# EAGLE schematic smart_probe (EAGLE 9.6.0)
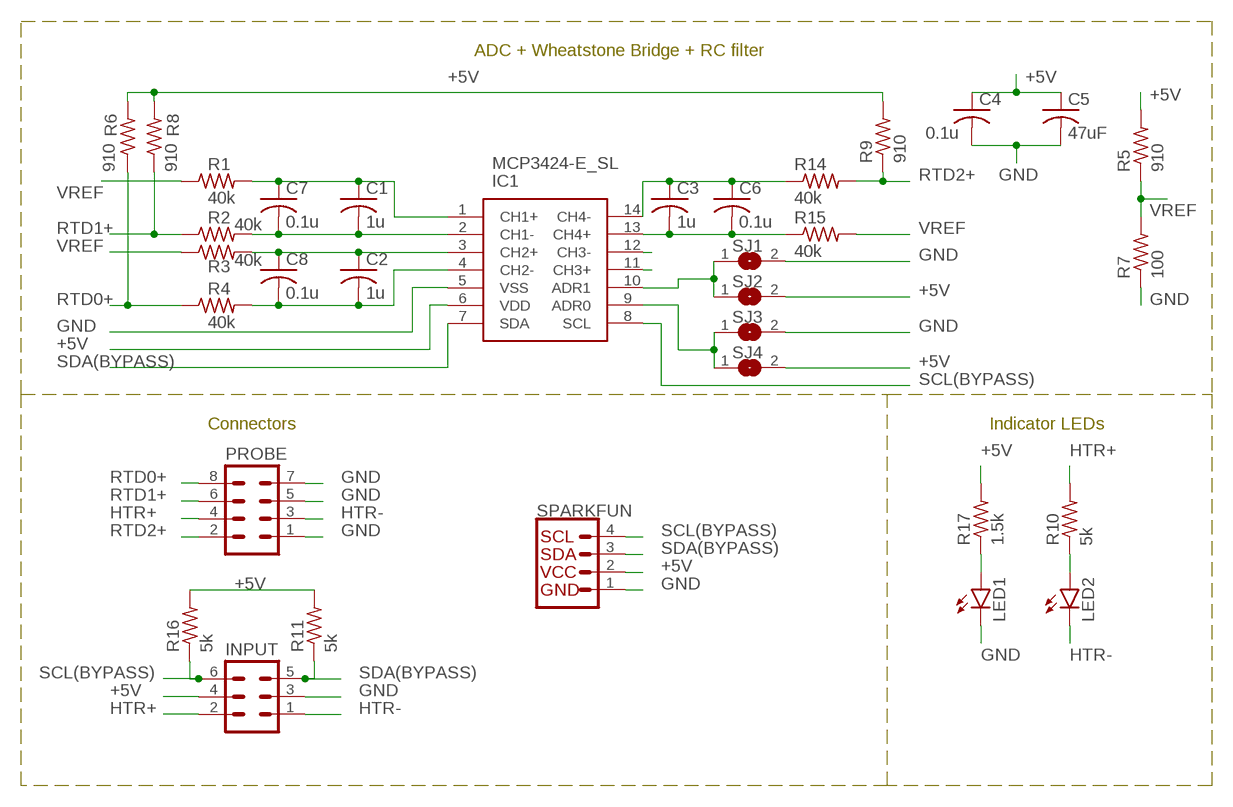
[diagram p0: schematic, sheet 1]

## Parts
C1  1u  C-USC0805  [C0805]
C2  1u  C-USC0805  [C0805]
C3  1u  C-USC0805  [C0805]
C4  0.1u  C-USC0805  [C0805]
C5  47uF  C-USC0805  [C0805]
C6  0.1u  C-USC0805  [C0805]
C7  0.1u  C-USC0805  [C0805]
C8  0.1u  C-USC0805  [C0805]
IC1  MCP3424-E_SL  [SOIC127P600X175-14N]
INPUT  MA03-2  [MA03-2]
LED1  LEDCHIP-LED0805  [CHIP-LED0805]
LED2  LEDCHIP-LED0805  [CHIP-LED0805]
PROBE  MA04-2  [MA04-2]
R1  40k  R-US_R0805  [R0805]
R2  40k  R-US_R0805  [R0805]
R3  40k  R-US_R0805  [R0805]
R4  40k  R-US_R0805  [R0805]
R5  910  R-US_R0805  [R0805]
R6  910  R-US_R0805  [R0805]
R7  100  R-US_R0805  [R0805]
R8  910  R-US_R0805  [R0805]
R9  910  R-US_R0805  [R0805]
R10  5k  R-US_R0805  [R0805]
R11  5k  R-US_R0805  [R0805]
R14  40k  R-US_R0805  [R0805]
R15  40k  R-US_R0805  [R0805]
R16  5k  R-US_R0805  [R0805]
R17  1.5k  R-US_R0805  [R0805]
SJ1  SJ  [SJ]
SJ2  SJ  [SJ]
SJ3  SJ  [SJ]
SJ4  SJ  [SJ]
SPARKFUN  I2C_STANDARD_NO_SILK  [1X04_NO_SILK]

## Nets
+5V: C4.1 C5.1 IC1.6(VDD) INPUT.4 R5.2 R6.2 R8.2 R9.2 R11.2 R16.2 R17.2 SJ2.2 SJ4.2 SPARKFUN.2(VCC)
CH1+: C1.1 C7.1 IC1.1(CH1+) R1.2
CH1-: C1.2 C7.2 IC1.2(CH1-) R2.2
CH2+: C2.1 C8.1 IC1.3(CH2+) R3.2
CH2-: C2.2 C8.2 IC1.4(CH2-) R4.2
CH3+: IC1.11(CH3+)
CH3-: IC1.12(CH3-)
CH4+: C3.2 C6.2 IC1.13(CH4+) R15.1
CH4-: C3.1 C6.1 IC1.14(CH4-) R14.1
GND: C4.2 C5.2 IC1.5(VSS) INPUT.3 LED1.C PROBE.1 PROBE.5 PROBE.7 R7.1 SJ1.2 SJ3.2 SPARKFUN.1(GND)
HTR+: INPUT.2 PROBE.4 R10.2
HTR-: INPUT.1 LED2.C PROBE.3
N$1: LED1.A R17.1
N$2: LED2.A R10.1
N$4: IC1.10(ADR1) SJ1.1 SJ2.1
N$5: IC1.9(ADR0) SJ3.1 SJ4.1
RTD0+: PROBE.8 R4.1 R6.1
RTD1+: PROBE.6 R2.1 R8.1
RTD2+: PROBE.2 R9.1 R14.2
SCL(BYPASS): IC1.8(SCL) INPUT.6 R16.1 SPARKFUN.4(SCL)
SDA(BYPASS): IC1.7(SDA) INPUT.5 R11.1 SPARKFUN.3(SDA)
VREF: R1.1 R3.1 R5.1 R7.2 R15.2

## Notes on the sheet
- ADC + Wheatstone Bridge + RC filter
- Connectors | Indicator LEDs

## Library data of the parts
C1-C8 = rcl:C-US: CAPACITOR, American symbol; SPICEPREFIX: C
IC1 = MCP3424-E_SL:MCP3424-E_SL: ADC 18-Bit 4-ch 2.048V I2C SOIC14 Source: Datasheet <http://ww1.microchip.com/downloads/en/DeviceDoc/22088c.pdf>; ALLIED_NUMBER: 70046797; ALLIED_PRICE-STOCK: http://www.alliedelec.com/microchip-technology-inc-mcp3424-e-sl/70046797/; DESCRIPTION: ADC 18-Bit 4-ch 2.048V I2C SOIC14; HEIGHT: 1.75mm; MANUFACTURER_NAME: Microchip; MANUFACTURER_PART_NUMBER: MCP3424-E/SL; MOUSER_PART_NUMBER: 579-MCP3424-E/SL; MOUSER_PRICE-STOCK: https://www.mouser.com/Search/Refine.aspx?Keyword=579-MCP3424-E%2FSL; RS_PART_NUMBER: 6696086P; RS_PRICE-STOCK: http://uk.rs-online.com/web/p/products/6696086P
INPUT = better_header:MA03-2: PIN HEADER; OC_FARNELL: unknown; OC_NEWARK: unknown
LED1 LED2 = led:LED: LED OSRAM: - CHIPLED LG R971, LG N971, LY N971, LG Q971, LY Q971, LO R971, LY R971 LH N974, LH R974 LS Q976, LO Q976, LY Q976 LO Q996 - Hyper CHIPLED LW Q18S LB Q993, LB Q99A, LB R99A - SideLED LS A670, LO A670, LY A670, LG A670, LP A670 LB A673, LV A673, LT A673, LW A673 LH A674 LY A675 LS A676, LA A676, LO A676, LY A676, LW A676 LS A679, LY A679, LG A679 - Hyper Micro SIDELED® LS Y876, LA Y876, LO Y876, LY Y876 LT Y87S - SmartLED LW L88C, LW L88S LB L89C, LB L89S, LG L890 LS L89K, LO L89K, LY L89K LS L896, LA L896, LO L896, LY L896 - TOPLED LS T670, LO T670, LY T670, LG T670, LP T670 LSG T670, LSP T670, LSY T670, LOP T670, LYG T670 LG T671, LOG T671, LSG T671 LB T673, LV T673, LT T673, LW T673 LH T674 LS T676, LA T676, LO T676, LY T676, LB T676, LH T676, LSB T676, LW T676 LB T67C, LV T67C, LT T67C, LS T67K, LO T67K, LY T67K, LW E67C LS E67B, LA E67B, LO E67B, LY E67B, LB E67C, LV E67C, LT E67C LW T67C LS T679, LY T679, LG T679 LS T770, LO T770, LY T770, LG T770, LP T770 LB T773, LV T773, LT T773, LW T773 LH T774 LS E675, LA E675, LY E675, LS T675 LS T776, LA T776, LO T776, LY T776, LB T776 LHGB T686 LT T68C, LB T68C - Hyper Mini TOPLED® LB M676 - Mini TOPLED Santana® LG M470 LS M47K, LO M47K, LY M47K Source: http://www.osram.convergy.de LUXEON: - LUMILED® LXK2-PW12-R00, LXK2-PW12-S00, LXK2-PW14-U00, LXK2-PW14-V00 LXK2-PM12-R00, LXK2-PM12-S00, LXK2-PM14-U00 LXK2-PE12-Q00, LXK2-PE12-R00, LXK2-PE12-S00, LXK2-PE14-T00, LXK2-PE14-U00 LXK2-PB12-K00, LXK2-PB12-L00, LXK2-PB12-M00, LXK2-PB14-N00, LXK2-PB14-P00, LXK2-PB14-Q00 LXK2-PR12-L00, LXK2-PR12-M00, LXK2-PR14-Q00, LXK2-PR14-R00 LXK2-PD12-Q00, LXK2-PD12-R00, LXK2-PD12-S00 LXK2-PH12-R00, LXK2-PH12-S00 LXK2-PL12-P00, LXK2-PL12-Q00, LXK2-PL12-R00 Source: www.luxeon.com KINGBRIGHT: KA-3528ASYC Source: www.kingbright.com
PROBE = better_header:MA04-2: PIN HEADER; OC_FARNELL: unknown; OC_NEWARK: unknown
R1-R11 R14-R17 = rcl:R-US_: RESISTOR, American symbol; SPICEPREFIX: R
SJ1-SJ4 = jumper:SJ: SMD solder JUMPER
SPARKFUN = SparkX:I2C_STANDARD: SparkFun I2C Standard Pinout Header SparkFun has standardized on a pinout for all I2C based sensor breakouts. This pinout allows I2C boards to be plugged directly into the headers on Arduino Uno compatible boards, and to be daisy chained easily. Example SparkFun Products: SparkFun Atmospheric Sensor Breakout - BME280 <https://www.sparkfun.com/products/13676> SparkFun Altitude/Pressure Sensor Breakout - MPL3115A2 <https://www.sparkfun.com/products/11084> SparkFun TOF Range Finder Sensor - VL6180 <https://www.sparkfun.com/products/12785>

## Module ADC
Ports: RTD1(io) RTD2(io) RTD3(io) AGND(io) +5V(io) GND(io) SCL1(io) SDA1(io) RDY1(io) SCL2(io) SDA2(io) RDY2(io)
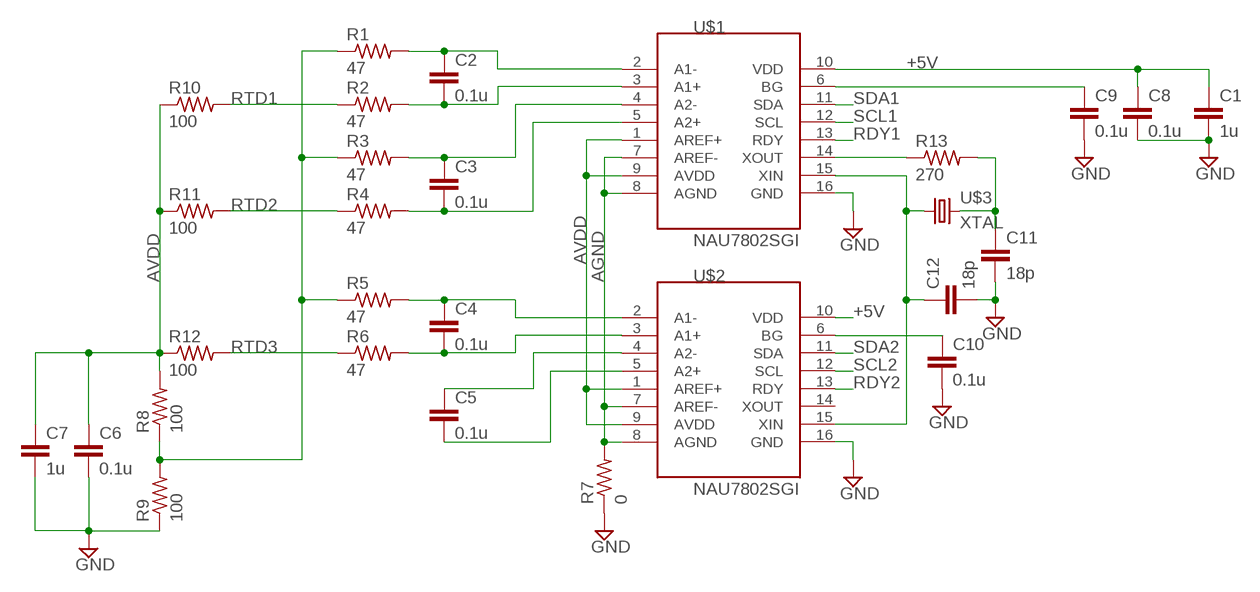
[diagram p1: schematic, module ADC, sheet 1]

### Parts
C1  1u  C-EUC0603  [C0603]
C2  0.1u  C-EUC0603  [C0603]
C3  0.1u  C-EUC0603  [C0603]
C4  0.1u  C-EUC0603  [C0603]
C5  0.1u  C-EUC0603  [C0603]
C6  0.1u  C-EUC0603  [C0603]
C7  1u  C-EUC0603  [C0603]
C8  0.1u  C-EUC0603  [C0603]
C9  0.1u  C-EUC0603  [C0603]
C10  0.1u  C-EUC0603  [C0603]
C11  18p  C-EUC0603  [C0603]
C12  18p  C-EUC0603  [C0603]
R1  47  R-US_R0603  [R0603]
R2  47  R-US_R0603  [R0603]
R3  47  R-US_R0603  [R0603]
R4  47  R-US_R0603  [R0603]
R5  47  R-US_R0603  [R0603]
R6  47  R-US_R0603  [R0603]
R7  0  R-US_R0603  [R0603]
R8  100  R-US_R0603  [R0603]
R9  100  R-US_R0603  [R0603]
R10  100  R-US_R0603  [R0603]
R11  100  R-US_R0603  [R0603]
R12  100  R-US_R0603  [R0603]
R13  270  R-US_R0603  [R0603]
U$1  NAU7802SGI  [SOIC127P600X175-16N]
U$2  NAU7802SGI  [SOIC127P600X175-16N]
U$3  XTAL  [XTAL1140X470X420N]

### Nets
+5V: C1.1 C8.1 U$1.10(VDD) U$2.10(VDD)
AGND: R7.2 U$1.7(AREF-) U$1.8(AGND) U$2.7(AREF-) U$2.8(AGND)
AVDD: C6.1 C7.1 R8.2 R10.1 R11.1 R12.1 U$1.1(AREF+) U$1.9(AVDD) U$2.1(AREF+) U$2.9(AVDD)
GND: C1.2 C6.2 C7.2 C8.2 C9.2 C10.2 C11.2 C12.2 R7.1 R9.1 U$1.16(GND) U$2.16(GND)
N$1: C2.1 R1.2 U$1.2(A1-)
N$2: C2.2 R2.2 U$1.3(A1+)
N$3: C9.1 U$1.6(BG)
N$4: C3.1 R3.2 U$1.4(A2-)
N$5: C3.2 R4.2 U$1.5(A2+)
N$6: R1.1 R3.1 R5.1 R8.1 R9.2
N$7: C4.1 R5.2 U$2.2(A1-)
N$8: C4.2 R6.2 U$2.3(A1+)
N$9: C5.1 U$2.4(A2-)
N$10: C5.2 U$2.5(A2+)
N$11: C12.1 U$1.15(XIN) U$2.15(XIN) U$3.1
N$12: C10.1 U$2.6(BG)
N$13: R13.1 U$1.14(XOUT)
N$14: C11.1 R13.2 U$3.2
RDY1: U$1.13(RDY)
RDY2: U$2.13(RDY)
RTD1: R2.1 R10.2
RTD2: R4.1 R11.2
RTD3: R6.1 R12.2
SCL1: U$1.12(SCL)
SCL2: U$2.12(SCL)
SDA1: U$1.11(SDA)
SDA2: U$2.11(SDA)
Unconnected: U$2.14(XOUT)

### Library data of the parts
C1-C12 = rcl:C-EU: CAPACITOR, European symbol; SPICEPREFIX: C
R1-R13 = rcl:R-US_: RESISTOR, American symbol; SPICEPREFIX: R
U$1 U$2 = sapflow:NAU7802SGI
U$3 = sapflow:XTAL